# Altium schematic sheet MISC.SchDoc: MISC
size A4
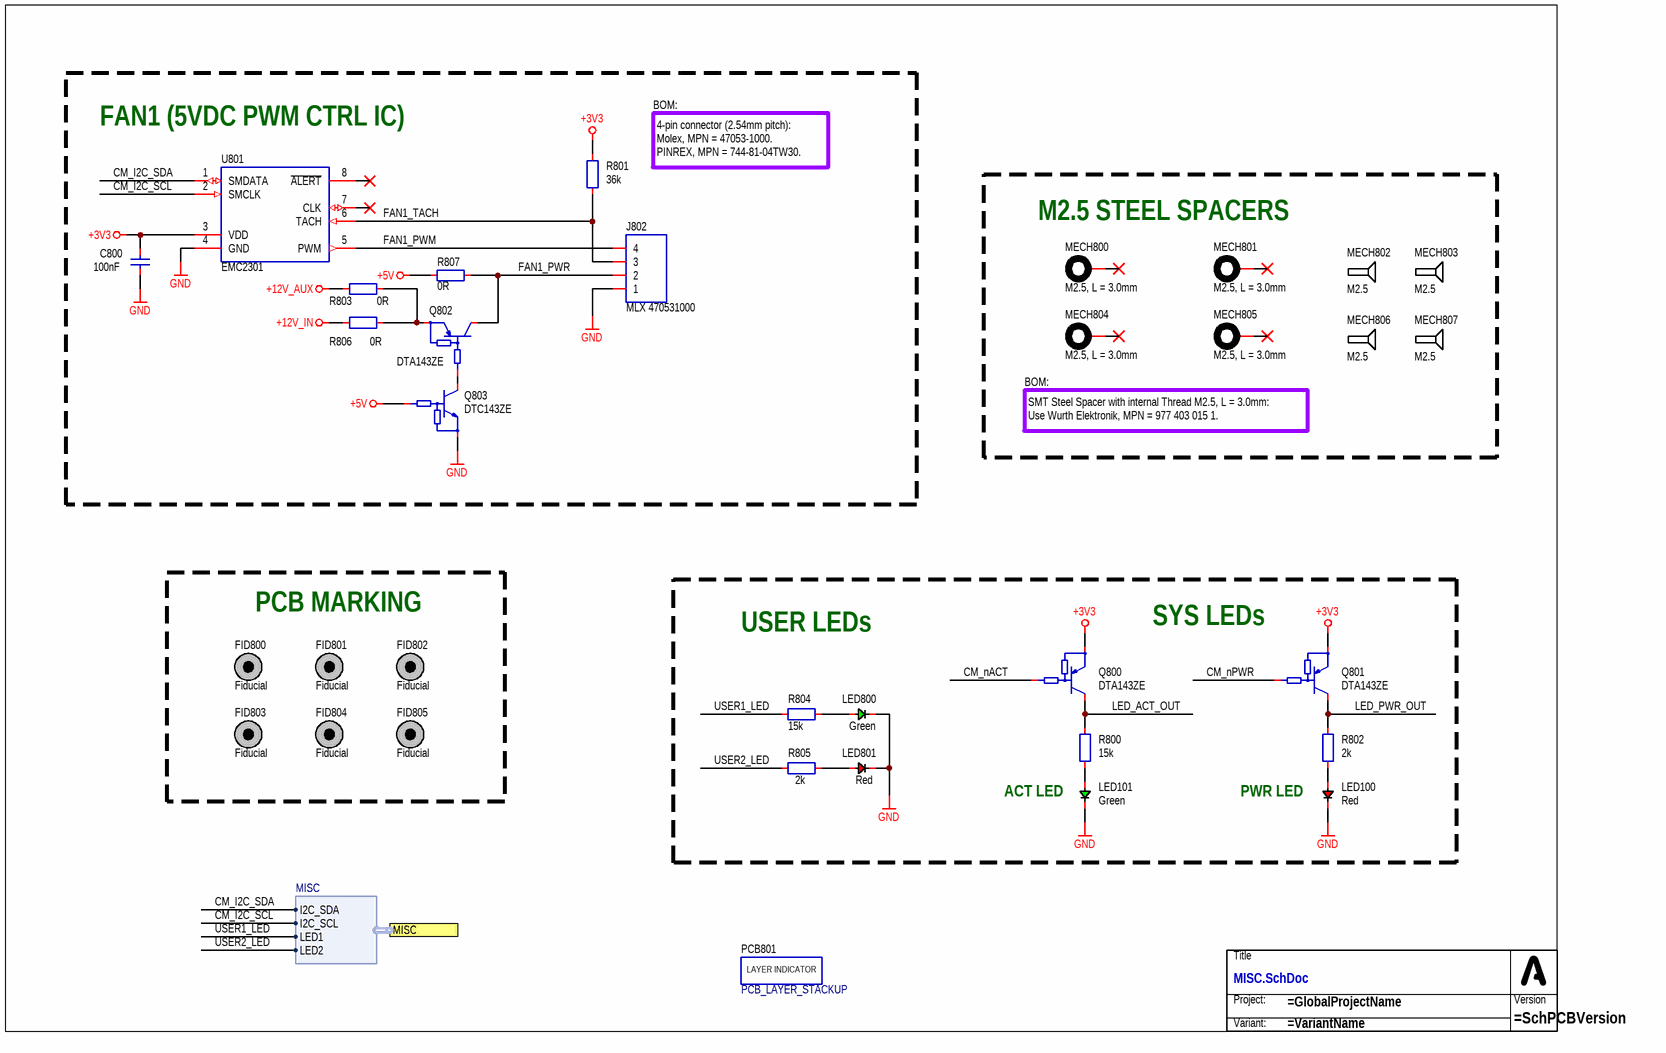
[diagram p0: MISC.SchDoc]

## Parts
C800  100nF  [CAP_0603_R]
FID800  Fiducial  [PCB_FID_RND_100x300]  (no BOM)
FID801  Fiducial  [PCB_FID_RND_100x300]  (no BOM)
FID802  Fiducial  [PCB_FID_RND_100x300]  (no BOM)
FID803  Fiducial  [PCB_FID_RND_100x300]  (no BOM)
FID804  Fiducial  [PCB_FID_RND_100x300]  (no BOM)
FID805  Fiducial  [PCB_FID_RND_100x300]  (no BOM)
J802  MLX 470531000  [CON_MLX_470531000]
LED100  Red  [LED_0805_RED_R]
LED101  Green  [LED_0805_GRN_R]
LED800  Green  [LED_0805_GRN_R]
LED801  Red  [LED_0805_RED_R]
MECH800  M2.5, L = 3.0mm  [PCB_WRT_9774030151]
MECH801  M2.5, L = 3.0mm  [PCB_WRT_9774030151]
MECH802  M2.5  (mechanical)
MECH803  M2.5  (mechanical)
MECH804  M2.5, L = 3.0mm  [PCB_WRT_9774030151]
MECH805  M2.5, L = 3.0mm  [PCB_WRT_9774030151]
MECH806  M2.5  (mechanical)
MECH807  M2.5  (mechanical)
PCB801  PCB_LAYER_STACKUP  [PCB_STACKUP-4L_A2]  (no BOM)
Q800  DTA143ZE  [PKG_SOT523_SC75_SOT416_P100_R]
Q801  DTA143ZE  [PKG_SOT523_SC75_SOT416_P100_R]
Q802  DTA143ZE  [PKG_SOT523_SC75_SOT416_P100_R]
Q803  DTC143ZE  [PKG_SOT523_SC75_SOT416_P100_R]
R800  15k  [RES_0603_R]
R801  36k  [RES_0603_R]
R802  2k  [RES_0603_R]
R803  0R  [RES_0603_R]
R804  15k  [RES_0603_R]
R805  2k  [RES_0603_R]
R806  0R  [RES_0603_R]
R807  0R  [RES_0603_R]
TB800  (no value)  (no BOM)
U801  EMC2301  [ICC_TSSOP8_300X300X110P65]

## Ports
MISC (harness MISC)

## Harnesses
MISC: I2C_SDA, I2C_SCL, LED1, LED2

## Nets
+3V3: C800.2 Q800.2(E) Q801.2(E) R801.2 U801.3(VDD)
+5V: Q803.1(B) R807.2
+12V_AUX: R803.2
+12V_IN: R806.2
GND: C800.1 J802.1 LED100.1 LED101.1 LED800.1 LED801.1 Q803.2(E) U801.4(GND)
CM_I2C_SCL: U801.2(SMCLK) ; port MISC.I2C_SCL
CM_I2C_SDA: U801.1(SMDATA) ; port MISC.I2C_SDA
CM_nACT: Q800.1(B)
CM_nPWR: Q801.1(B)
FAN1_PWM: J802.4 U801.5(PWM)
FAN1_PWR: J802.2 Q802.3(C) R807.1
FAN1_TACH: J802.3 R801.1 U801.6(TACH)
LED_ACT_OUT: Q800.3(C) R800.2
LED_PWR_OUT: Q801.3(C) R802.2
USER1_LED: R804.1 ; port MISC.LED1
USER2_LED: R805.1 ; port MISC.LED2
NetLED100_2: LED100.2 R802.1
NetLED101_2: LED101.2 R800.1
NetLED800_2: LED800.2 R804.2
NetLED801_2: LED801.2 R805.2
NetQ802_1: Q802.1(B) Q803.3(C)
NetQ802_2: Q802.2(E) R803.1 R806.1

Not connected (* = marked no-connect by the designer): MECH800 1*; MECH801 1*; MECH804 1*; MECH805 1*; U801 7(CLK)* 8(~{ALERT})*

## Notes on the sheet
- BOM:
- (near U801) FAN1 (5VDC PWM CTRL IC)
- 4-pin connector (2.54mm pitch):
  Molex, MPN = 47053-1000.
  PINREX, MPN = 744-81-04TW30.
- M2.5 STEEL SPACERS
- SMT Steel Spacer with internal Thread M2.5, L = 3.0mm:
  Use Wurth Elektronik, MPN = 977 403 015 1.
- PCB MARKING
- USER LEDs
- (near Q801) SYS LEDs
- ACT LED
- PWR LED
- (in symbol PCB_LAYER_STACKUP) LAYER INDICATOR
- (in symbol SCH_TITLE_BLOCK_SIMPLE_NODATE) Title; Project:; Version; Variant:

## Library data of the parts
C800 = CAP-0008: Capacitor; MLCC; 100nF; 10V X5R; Manufacturer: YAGEO; MPN: CC0603KRX7R9BB104; Package (Case): 0603; Component Type: Capacitor; Component Subtype: MLCC; Value: 100nF; Mounting Type: SMD
FID800-FID805 = PCB_FID_RND: PCB Marking; Fiducial; Round;; Value: Fiducial; Component Type: Fiducial
J802 = CON_1X04_COL: Connector; 1 Row; 470531000; Manufacturer: Molex; Component Subtype: Pin header; Package (Case): THT; Component Type: Connector; Mounting Type: THT; MPN: 470531000; Value: MLX 470531000
LED100 LED801 = DIO_LED_RED: Diode; LED; Red;; Manufacturer: Foshan NationStar Optoelectronics; MPN: NCD0805R1; Component Subtype: LED Diode; Package (Case): 0805; Value: Red; Component Type: LED; Mounting Type: SMD
LED101 LED800 = DIO_LED_GRN: Diode; LED; Green;; Manufacturer: Foshan NationStar Optoelectronics; MPN: NCD0805G1; Component Subtype: LED Diode; Package (Case): 0805; Value: Green; Component Type: LED; Mounting Type: SMD
MECH800 MECH801 MECH804 MECH805 = PCB_MECH_WRT_WA-SMSI: PCB; Mechanical; SMT Steel Spacer; M2.5;; Manufacturer: Wurth Elektronik; MPN: 977 403 015 1; Component Subtype: SMD Spacer; Package (Case): SMD; Value: M2.5, L = 3.0mm; Component Type: Spacer (Standoff); Mounting Type: SMD
MECH802 MECH803 MECH806 MECH807 = PCB_MECH_SCR: Mechnical; Screw;; MPN: M2.5 screw; Value: M2.5
Q800-Q802 = TRA_BJT_PNP_DIG_ONS_DTA143ZE: Transistor; BJT; PNP; Digital;; Manufacturer: On Semiconductor; Component Subtype: PNPTransistor; Package (Case): SOT-523; Component Type: Transistor; Mounting Type: SMD; MPN: DTA143ZE; Value: DTA143ZE
Q803 = TRA_BJT_NPN_DIG_BEC: Transistor; BJT; NPN; Digital;; Manufacturer: On Semiconductor; Component Subtype: NPN Transistor; Package (Case): SOT-523; Value: DTC143ZE; MPN: DTC143ZE; Component Type: Transistor; Mounting Type: SMD
R800 R804 = RES-0043: Resistor; Thick Film; 15k; 1%; 100mW; 100PPM; 75V; Standard; SMD; 0603 (1608);; Manufacturer: UNI-ROYAL(Uniroyal Elec); MPN: 0603WAF1502T5E; Package (Case): 0603; Component Type: Resistor; Component Subtype: Thick Film; Value: 15k; Mounting Type: SMD
R801 = RES-0054: Resistor; Thick Film; 36k; SMD; 0603 (1608);; Manufacturer: UNI-ROYAL(Uniroyal Elec); MPN: 0603WAF3602T5E; Package (Case): 0603; Component Type: Resistor; Component Subtype: Thick Film; Value: 36k; Mounting Type: SMD
R802 R805 = RES-0033: Resistor; Thick Film; 2k2; 1%; 100mW; 100PPM; 75V; Standard; SMD; 0603 (1608);; Manufacturer: UNI-ROYAL(Uniroyal Elec); MPN: 0603WAF2001T5E; Package (Case): 0603; Component Type: Resistor; Component Subtype: Thick Film; Value: 2k; Mounting Type: SMD
R803 R806 R807 = RES-0054: Resistor; Thick Film; 0R; SMD; 0603 (1608);; Manufacturer: UNI-ROYAL(Uniroyal Elec); MPN: 0603WAF0000T5E; Package (Case): 0603; Component Type: Resistor; Component Subtype: Thick Film; Value: 0R; Mounting Type: SMD
TB800 = SCH_TITLE_BLOCK_SIMPLE_NODATE
U801 = ICC_MCP_EMC2301_MSOP-8: IC; Fan controller;; Manufacturer: Microchip Technology; MPN: EMC2301-1-ACZL-TR; Package (Case): MSOP-8; Component Subtype: Fan controller; Component Type: IC; Mounting Type: SMD; Value: EMC2301
PCB801 = PCB_LAYER_STACKUP: Component Type: PCB Marking